# Altium schematic sheet pre_carga_logica.SchDoc
size A
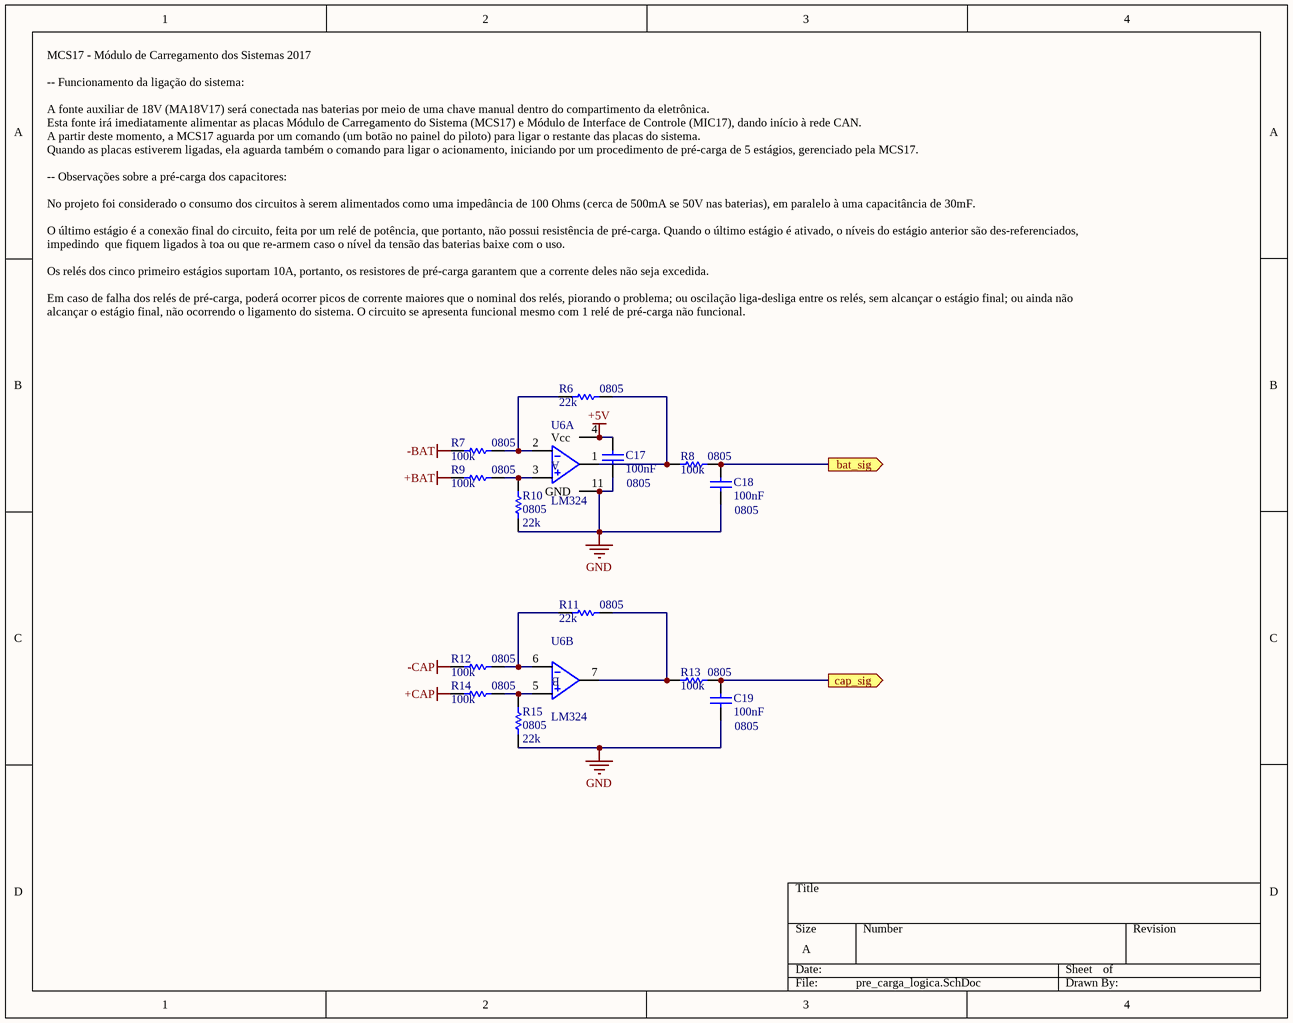
[diagram p0: pre_carga_logica.SchDoc]

## Parts
C17  100nF  Footprint: 0805  [0805C]
C18  100nF  Footprint: 0805  [0805C]
C19  100nF  Footprint: 0805  [0805C]
R6  0805  value 22k  [0805C]
R7  0805  value 100k  [0805C]
R8  0805  value 100k  [0805C]
R9  0805  value 100k  [0805C]
R10  0805  value 22k  [0805C]
R11  0805  value 22k  [0805C]
R12  0805  value 100k  [0805C]
R13  0805  value 100k  [0805C]
R14  0805  value 100k  [0805C]
R15  0805  value 22k  [0805C]
U6  LM324  [SOIC14-150(50)]  (parts A,B of 4)

## Ports
bat_sig (out), cap_sig (out)

## Nets
+5V: C17.2 U6.4(Vcc)
+BAT: R9.2
+CAP: R14.2
-BAT: R7.2
-CAP: R12.2
GND: C17.1 C18.1 C19.1 R10.2 R15.2 U6.11(GND)
bat_sig: C18.2 R8.1 ; port bat_sig
cap_sig: C19.2 R13.1 ; port cap_sig
NetR6_1: R6.1 R8.2 U6.1(O1)
NetR6_2: R6.2 R7.1 U6.2(IN1-)
NetR9_1: R9.1 R10.1 U6.3(IN1+)
NetR11_1: R11.1 R13.2 U6.7(O2)
NetR11_2: R11.2 R12.1 U6.6(IN2-)
NetR14_1: R14.1 R15.1 U6.5(IN2+)

## Notes on the sheet
- MCS17 - Módulo de Carregamento dos Sistemas 2017
  -- Funcionamento da ligação do sistema:
  A fonte auxiliar de 18V (MA18V17) será conectada nas baterias por meio de uma chave manual dentro do compartimento da eletrônica.
  Esta fonte irá imediatamente alimentar as placas Módulo de Carregamento do Sistema (MCS17) e Módulo de Interface de Controle (MIC17), dando início à rede CAN.
  A partir deste momento, a MCS17 aguarda por um comando (um botão no painel do piloto) para ligar o restante das placas do sistema.
  Quando as placas estiverem ligadas, ela aguarda também o comando para ligar o acionamento, iniciando por um procedimento de pré-carga de 5 estágios, gerenciado pela MCS17.
  -- Observações sobre a pré-carga dos capacitores:
  No projeto foi considerado o consumo dos circuitos à serem alimentados como uma impedância de 100 Ohms (cerca de 500mA se 50V nas baterias), em paralelo à uma capacitância de 30mF.
  O último estágio é a conexão final do circuito, feita por um relé de potência, que portanto, não possui resistência de pré-carga. Quando o último estágio é ativado, o níveis do estágio anterior são des-referenciados, impedindo  que fiquem ligados à toa ou que re-armem caso o nível da tensão das baterias baixe com o uso.
  Os relés dos cinco primeiro estágios suportam 10A, portanto, os resistores de pré-carga garantem que a corrente deles não seja excedida.
  Em caso de falha dos relés de pré-carga, poderá ocorrer picos de corrente maiores que o nominal dos relés, piorando o problema; ou oscilação liga-desliga entre os relés, sem alcançar o estágio final; ou ainda não alcançar o estágio final, não ocorrendo o ligamento do sistema. O circuito se apresenta funcional mesmo com 1 relé de pré-carga não funcional.
- (in symbol LM324, part A) A
- (in symbol LM324, part B) B

## Library data of the parts
C17-C19 = Cap: Capacitor; Voltage: 25V; Type: pth; LatestRevisionNote: Re-released for DXP Platform.; PackageReference: RAD-0.3; Value: 100nF
R6-R15 = Res1: Resistor; LatestRevisionNote: Re-released for DXP Platform.; PackageReference: AXIAL-0.3; Type: 0805
U6 = LM324: Quadruple Operational Amplifier